# Altium project Humpback.PrjPCB (part 3 of 4)

## Sheet FPGA_Config.SchDoc: Humpback
size 420 x 297 mm; EDA_Number: ARTIQ; Projet: Humpback; Author: G.Kasprowicz; CompanyName: WUT ISE; DrawnBy: G.Kasprowicz; Organization: WUT ISE; Address1: PW ISE; Address2: Nowowiejska 15/19 00-665 Warsaw; Address3: gkasprow@gmail.com; DocumentNumber: 4; Revision: 1.0; SheetNumber: 4; SheetTotal: 11; ModifiedBy: -; CheckedDate: -; Title2: FPGA Configuration v1.0; DivGrp: WUT ISE; Designer: G.Kasprowicz; ModifiedDate: -; ProjectName: Sensor Box
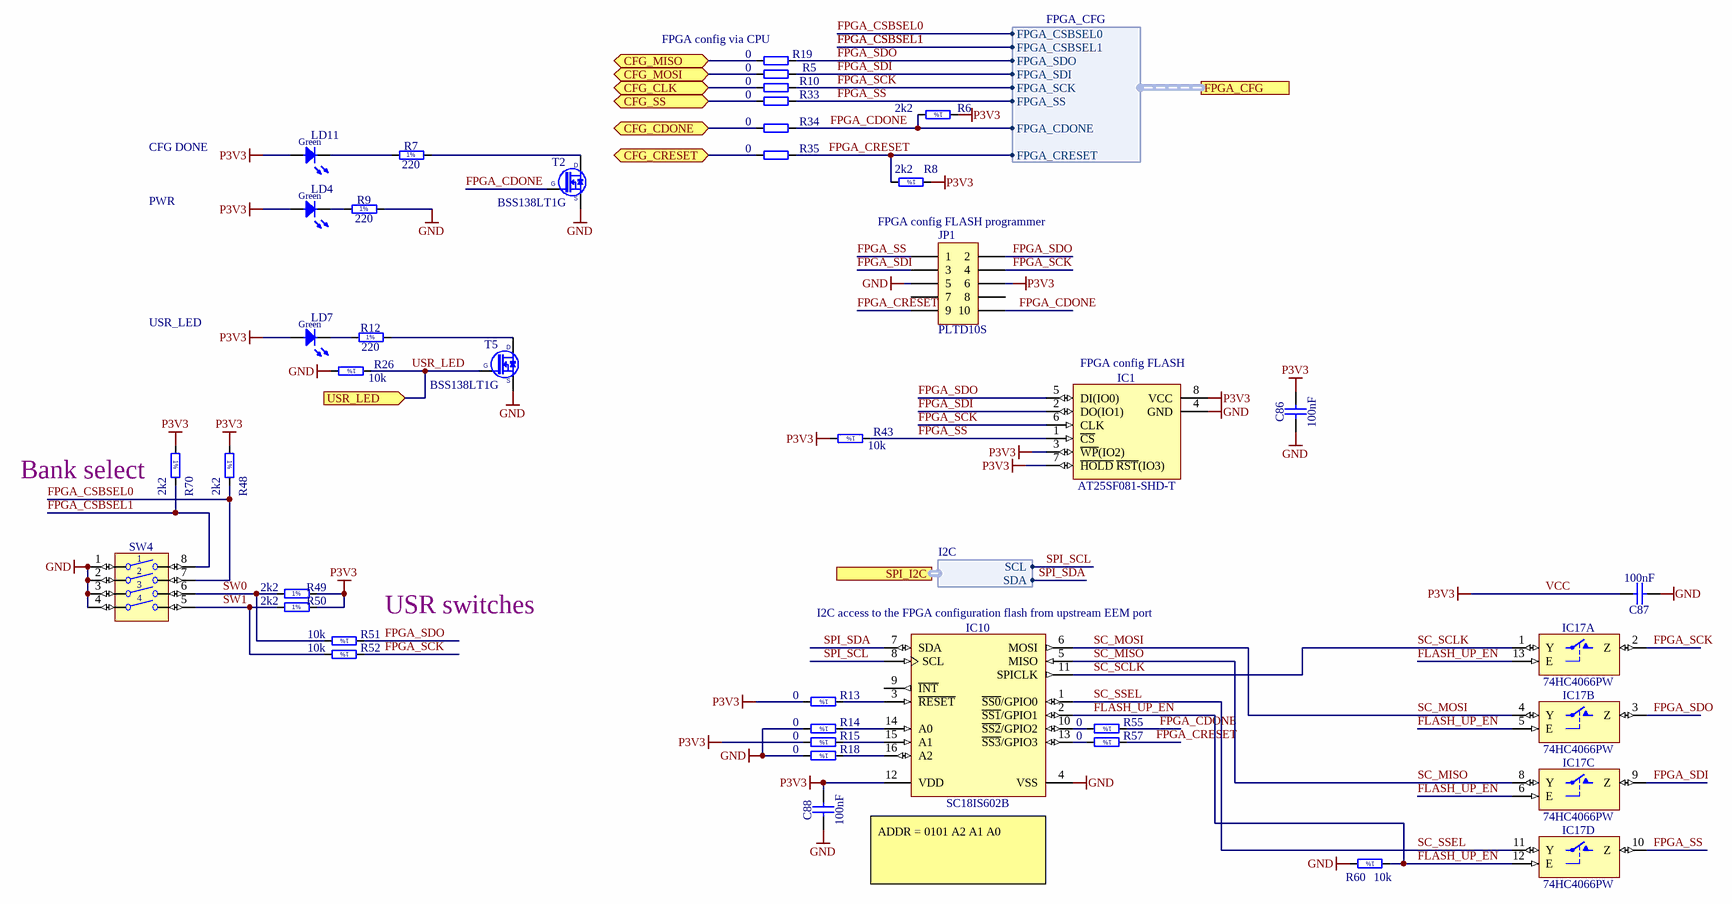
[diagram p5: FPGA_Config.SchDoc]

### Parts
C86  100nF  [CAPC1005X55N]
C87  100nF  [CAPC1005X55N]
C88  100nF  [CAPC1005X55N]
IC1  AT25SF081-SHD-T  [SOIC127P790X216-8N]
IC10  SC18IS602B  [SOP65P640X110-16N]
IC17  74HC4066PW  [SOP65P640X110-14N]  (parts A,B,C,D of 4)
JP1  PLTD10S  [PLTD10S]
LD4  Green  [LED_AVAGO_HSME-C120]  (value not drawn)
LD7  Green  [LED_AVAGO_HSME-C120]  (value not drawn)
LD11  Green  [LED_AVAGO_HSME-C120]  (value not drawn)
R5  0  [RESC1608X55N]
R6  2k2  [RESC1005X40N]
R7  220  [RESC1608X55N]
R8  2k2  [RESC1005X40N]
R9  220  [RESC1608X55N]
R10  0  [RESC1608X55N]
R12  220  [RESC1608X55N]
R13  0  [RESC1608X55N]
R14  0  [RESC1608X55N]
R15  0  [RESC1608X55N]
R18  0  [RESC1608X55N]
R19  0  [RESC1608X55N]
R26  10k  [RESC1005X40N]
R33  0  [RESC1608X55N]
R34  0  [RESC1608X55N]
R35  0  [RESC1608X55N]
R43  10k  [RESC1005X40N]
R48  2k2  [RESC1005X40N]
R49  2k2  [RESC1005X40N]
R50  2k2  [RESC1005X40N]
R51  10k  [RESC1005X40N]
R52  10k  [RESC1005X40N]
R55  0  [RESC1608X55N]
R57  0  [RESC1608X55N]
R60  10k  [RESC1005X40N]
R70  2k2  [RESC1005X40N]
SW4  Switch  [SW_TYCO_1571983-4]  (value not drawn)
T2  BSS138LT1G  [SOT95P240X110-3N]
T5  BSS138LT1G  [SOT95P240X110-3N]

### Ports
CFG_CDONE (bidir), CFG_CLK (bidir), CFG_CRESET (bidir), CFG_MISO (bidir), CFG_MOSI (bidir), CFG_SS (bidir), FPGA_CFG (harness FPGA_CFG), SPI_I2C (harness I2C), USR_LED (in)

### Harnesses
I2C: SDA, SCL
FPGA_CFG: FPGA_CSBSEL0, FPGA_CSBSEL1, FPGA_SDO, FPGA_SDI, FPGA_SCK, FPGA_SS, FPGA_CDONE, FPGA_CRESET

### Nets
GND: C86.1 C87.1 C88.1 IC1.4(GND) IC10.4(VSS) IC17.7(GND) JP1.5 R9.2 R14.2 R18.2 R26.2 R60.2 SW4.1 SW4.2 SW4.3 SW4.4 T2.2(S) T5.2(S)
P3V3: C86.2 C87.2 C88.2 IC1.3(~{WP}(IO2)) IC1.7(~{HOLD}_~{RST}(IO3)) IC1.8(VCC) IC10.12(VDD) IC17.14(VCC) JP1.6 LD4.2(A) LD7.2(A) LD11.2(A) R6.1 R8.1 R13.2 R15.2 R43.2 R48.1 R49.2 R50.2 R70.1  [also labelled VCC]
CFG_CDONE: R34.1 ; port CFG_CDONE
CFG_CLK: R10.1 ; port CFG_CLK
CFG_CRESET: R35.1 ; port CFG_CRESET
CFG_MISO: R19.1 ; port CFG_MISO
CFG_MOSI: R5.1 ; port CFG_MOSI
CFG_SS: R33.1 ; port CFG_SS
FLASH_UP_EN: IC10.2(~{SS1}/GPIO1) IC17.5(E) IC17.6(E) IC17.12(E) IC17.13(E) R60.1
FPGA_CDONE: JP1.10 R6.2 R34.2 R55.1 T2.1(G) ; port FPGA_CFG.FPGA_CDONE
FPGA_CRESET: JP1.9 R8.2 R35.2 R57.1 ; port FPGA_CFG.FPGA_CRESET
FPGA_CSBSEL0: R48.2 SW4.7 ; port FPGA_CFG.FPGA_CSBSEL0
FPGA_CSBSEL1: R70.2 SW4.8 ; port FPGA_CFG.FPGA_CSBSEL1
FPGA_SCK: IC1.6(CLK) IC17.2(Z) JP1.4 R10.2 R52.1 ; port FPGA_CFG.FPGA_SCK
FPGA_SDI: IC1.2(DO(IO1)) IC17.9(Z) JP1.3 R5.2 ; port FPGA_CFG.FPGA_SDI
FPGA_SDO: IC1.5(DI(IO0)) IC17.3(Z) JP1.2 R19.2 R51.1 ; port FPGA_CFG.FPGA_SDO
FPGA_SS: IC1.1(~{CS}) IC17.10(Z) JP1.1 R33.2 R43.1 ; port FPGA_CFG.FPGA_SS
SC_MISO: IC10.5(MISO) IC17.8(Y)
SC_MOSI: IC10.6(MOSI) IC17.4(Y)
SC_SCLK: IC10.11(SPICLK) IC17.1(Y)
SC_SSEL: IC10.1(~{SS0}/GPIO0) IC17.11(Y)
SPI_SCL: IC10.8(SCL) ; port SPI_I2C.SCL
SPI_SDA: IC10.7(SDA) ; port SPI_I2C.SDA
SW0: R49.1 R51.2 SW4.6
SW1: R50.1 R52.2 SW4.5
USR_LED: R26.1 T5.1(G) ; port USR_LED
NetIC10_3: IC10.3(~{RESET}) R13.1
NetIC10_10: IC10.10(~{SS2}/GPIO2) R55.2
NetIC10_13: IC10.13(~{SS3}/GPIO3) R57.2
NetIC10_14: IC10.14(A0) R14.1
NetIC10_15: IC10.15(A1) R15.1
NetIC10_16: IC10.16(A2) R18.1
NetLD4_1: LD4.1(C) R9.1
NetLD7_1: LD7.1(C) R12.1
NetLD11_1: LD11.1(C) R7.1
NetR7_2: R7.2 T2.3(D)
NetR12_2: R12.2 T5.3(D)

Not connected (* = marked no-connect by the designer): IC10 9(~{INT}); JP1 7 8

### Notes on the sheet
- (near R19) FPGA config via CPU
- CFG DONE
- PWR
- FPGA config FLASH programmer
- USR_LED
- (near IC1) FPGA config FLASH
- (near R70) Bank select
- USR switches
- (near IC10) I2C access to the FPGA configuration flash from upstream EEM port
- ADDR = 0101 A2 A1 A0
- Project/Equipment
- Document
- Designer
- Drawn by
- Check.by
- Copyright WUT ISE 2018.
  This documentation describes Open Hardware and is licensed under the CERN OHL v.1.1. You may redistribute and modify this documentation under the terms of the CERN OHL v.1.1. (http://ohwr.org/CERNOHL). This documentation is distributed WITHOUT ANY EXPRESS OR IMPLIED WARRANTY, INCLUDING OF MERCHANTABILITY, SATISFACTORY QUALITY AND FITNESS FOR A PARTICULAR PURPOSE. Please see the CERN OHL v.1.1 for applicable conditions.
- Contact
- File
- Last Mod.
- Print Date
- Sheet
- Size
- A3
- of
- Rev
- (in symbol R0402_2K2_1%_0.0625W_100PPM) 1%
- (in symbol R0402_10K_1%_0.0625W_100PPM) 1%
- (in symbol R0603_0R_JUMPER) 1%
- (in symbol R0603_220R_1%_0.1W_100PPM) 1%

### Library data of the parts
C86-C88 = CC0402_100NF_16V_10%_X5R: Non-polarised capacitor; Part Description: SMD Multilayer Chip Ceramic Capacitor; Manufacturer: GENERIC; Manufacturer1 Part Number: GRM155R61C104KA88D; Voltage: 16V; TC: X5R; Tolerance: ±10%; Part Number: CC0402_100NF_16V_10%_X5R; Component Kind: Standard; Component Type: Standard; Pin Count: 2; Value: 100nF; Status: None; Manufacturer Part Number: CC0402_100NF_16V_10%_X5R; Case: 0402; Mounted: Yes; Socket: No; SMD: Yes; Sense: No; Manufacturer1 Example: MURATA; Manufacturer1 ComponentHeight: 0.55mm; HelpURL: \\cern.ch\dfs\Applications\Altium\Datasheets\CC0402_X5R_MURATA_GRM.pdf; Author: CERN DEM JLC; CreateDate: 10.12.2013; LatestRevisionDate: 10.12.2013
IC1 = MEM_AT25SF081-SHD-T: 8M-bit Serial Flash Memory with uniform 4KB sectors and Dual/Quad SPI and QPI; Manufacturer: ADESTO; PressFit: No; Bonding: No; Part Number: AT25SF081-SHD-T; Component Kind: Standard; Component Type: Standard; Device: AT25SF081-SHD-T; PackageDescription: SOIC, 1.27mm Pitch; 8 Pin, 5.285mm W X 5.335mm L X 2.16mm H body, IPC Medium Density; Part Description: 8M-bit Serial Flash Memory with uniform 4KB sectors and Dual/Quad SPI and QPI; Manufacturer Part Number: AT25SF081-SHD-T; Pin Count: 8; Case: SOIC8; Mounted: Yes; Socket: No; SMD: Yes; Sense: No; ComponentHeight: 2.16mm; HelpURL: \\cern.ch\dfs\Applications\Altium\Datasheets\W25Q128FVSIG.pdf; Author: GK; CreateDate: 26/01/2018; LatestRevisionDate: 26/01/2018
IC10 = SC18IS602B: I2C-bus to SPI bridge; Manufacturer: NXP SEMICONDUCTORS; PressFit: No; Bonding: No; Part Number: SC18IS602B; Component Kind: Standard; Component Type: Standard; Device: SC18IS602B; PackageDescription: SOP, 0.65mm pitch; 16 pin, 4.40mm W X 5.00mm L X 1.10mm H body IPC Medium Density; Part Description: I2C-Bus to SPI Bridge; Manufacturer Part Number: SC18IS602B; Pin Count: 16; Case: TSSOP16; Mounted: Yes; Socket: No; SMD: Yes; Sense: No; ComponentHeight: 1.1mm; HelpURL: \\cern.ch\dfs\Applications\Altium\Datasheets\SC18IS602B.pdf; Author: CERN DEM MR; CreateDate: 14/12/2015; LatestRevisionDate: 14/12/2015
IC17 = 74HC4066PW: Part Description: Quad Single-Pole Single-Throw Analog Switch; Manufacturer: NXP SEMICONDUCTORS; PressFit: No; Bonding: No; Table: Standard Logic; Part Number: 74HC4066PW; Component Kind: Standard; Component Type: Standard; Device: 74HC4066PW; PackageDescription: SOP, 14-Leads, Body 4.4x5mm (max), Pitch 0.65mm, IPC Medium Density; Manufacturer Part Number: 74HC4066PW; Pin Count: 14; Case: TSSOP14; Mounted: Yes; Socket: No; SMD: Yes; ComponentHeight: 1.1mm; Author: CERN DEM JLC; HelpURL: \\cern.ch\dfs\Applications\Altium\Datasheets\74HC4066PW.pdf; CreateDate: 2014-11-19; LatestRevisionDate: 2014-11-19
JP1 = CON_2x5 2.54 male SMT: Goldpin 2.54mm, male header
LD4 LD7 LD11 = LED_AVAGO_HSME-C120: LED Green 1C 2A; Part Description: High Performance Right Angle Chip Green LED; Manufacturer: AVAGO TECHNOLOGIES; PressFit: No; Bonding: No; Part Number: LED_AVAGO_HSME-C120; Component Kind: Standard; Component Type: Standard; Color: Green; PackageDescription: Green Chip LED, 2-Leads, Body 1.7x1.1mm, Side Emitting Package; Manufacturer Part Number: HSME-C120; Pin Count: 2; Mounted: Yes; Socket: No; SMD: Yes; Sense: No; ComponentHeight: 0.7mm; HelpURL: \\cern.ch\dfs\Applications\Altium\Datasheets\LED_AVAGO_HSME-C120.pdf; ComponentLink1URL: \\cern.ch\dfs\Applications\Altium\Datasheets\LED_AVAGO_HSME-C110_DESIGN-GUIDE.pdf; ComponentLink1Description: Design Guide; Author: CERN DEM JMW; CreateDate: 22.07.2009; LatestRevisionDate: 20.06.2012
R5 R10 R19 R33-R35 = R0603_0R_JUMPER: Resistor; Part Description: 1A (0.05R Max DC Resistance) Zero Ohm Jumper; Manufacturer: GENERIC; Manufacturer1 Part Number: NRC06Z0; PressFit: No; Part Number: R0603_0R_JUMPER; Component Kind: Standard; Component Type: Standard; Pin Count: 2; Value: 0; Status: Preferred; Manufacturer Part Number: R0603_0R_JUMPER; Case: 0603; Mounted: Yes; Sense: No; Socket: No; SMD: Yes; Manufacturer1 Example: NIC COMPONENT; Manufacturer1 ComponentHeight: 0.55mm; HelpURL: \\cern.ch\dfs\Applications\Altium\Datasheets\R0603_NIC_NRC.pdf; Author: CERN DEM JLC; CreateDate: 03/12/2007; LatestRevisionDate: 13/03/2008
R6 R8 R48-R50 R70 = R0402_2K2_1%_0.0625W_100PPM: Resistor - 1%; Part Description: General Purpose Thick Film Chip Resistor; Manufacturer: GENERIC; Manufacturer1 Part Number: 232270672202L; TC: ±100ppm/°C; Table: Resistors SMD; Part Number: R0402_2K2_1%_0.0625W_100PPM; Component Kind: Standard; Component Type: Standard; Pin Count: 2; Value: 2k2; Status: Not recommended; Power: 0.0625W; Tolerance: ±1%; Manufacturer Part Number: R0402_2K2_1%_0.0625W_100PPM; Case: 0402; Mounted: Yes; Socket: No; SMD: Yes; Manufacturer1 Example: YAGEO PHYCOMP; Manufacturer1 ComponentHeight: 0.4mm; HelpURL: \\cern.ch\dfs\Applications\Altium\Datasheets\R0402_Phycomp_RC0402.pdf; Author: CERN DEM JLC; CreateDate: 2007-12-03; LatestRevisionDate: 2012-10-17
R7 R9 R12 = R0603_220R_1%_0.1W_100PPM: Resistor - 1%; Part Description: General Purpose Thick Film Chip Resistor; Manufacturer: GENERIC; Manufacturer1 Part Number: NRC06F2200TRF; Power: 0.1W; TC: ±100ppm/°C; Part Number: R0603_220R_1%_0.1W_100PPM; Component Kind: Standard; Component Type: Standard; Pin Count: 2; Value: 220; Status: Preferred; Tolerance: ±1%; Manufacturer Part Number: R0603_220R_1%_0.1W_100PPM; Case: 0603; Mounted: Yes; Sense: No; Socket: No; SMD: Yes; Manufacturer1 Example: NIC COMPONENT; Manufacturer1 ComponentHeight: 0.55mm; HelpURL: \\cern.ch\dfs\Applications\Altium\Datasheets\R0603_NIC_NRC.pdf; Author: CERN DEM JLC; CreateDate: 03.12.2007; LatestRevisionDate: 13.03.2008
R13-R15 R18 R55 R57 = R0603_0R_JUMPER: Resistor - 1%; Part Description: 1A (0.05R Max DC Resistance) Zero Ohm Jumper; Manufacturer: GENERIC; Manufacturer1 Part Number: NRC06Z0; Table: Resistors SMD; Part Number: R0603_0R_JUMPER; Component Kind: Standard; Component Type: Standard; Pin Count: 2; Value: 0; Status: Preferred; Manufacturer Part Number: R0603_0R_JUMPER; Case: 0603; Mounted: Yes; Socket: No; SMD: Yes; Manufacturer1 Example: NIC COMPONENT; Manufacturer1 ComponentHeight: 0.55mm; HelpURL: \\cern.ch\dfs\Applications\Altium\Datasheets\R0603_NIC_NRC.pdf; Author: CERN DEM JLC; CreateDate: 2007-12-03; LatestRevisionDate: 2008-03-13
R26 R43 R51 R52 R60 = R0402_10K_1%_0.0625W_100PPM: Resistor - 1%; Part Description: General Purpose Thick Film Chip Resistor; Manufacturer: GENERIC; Manufacturer1 Part Number: 232270671003L; TC: ±100ppm/°C; Table: Resistors SMD; Part Number: R0402_10K_1%_0.0625W_100PPM; Component Kind: Standard; Component Type: Standard; Pin Count: 2; Value: 10k; Status: Not recommended; Power: 0.0625W; Tolerance: ±1%; Manufacturer Part Number: R0402_10K_1%_0.0625W_100PPM; Case: 0402; Mounted: Yes; Socket: No; SMD: Yes; Manufacturer1 Example: YAGEO PHYCOMP; Manufacturer1 ComponentHeight: 0.4mm; HelpURL: \\cern.ch\dfs\Applications\Altium\Datasheets\R0402_Phycomp_RC0402.pdf; Author: CERN DEM JLC; CreateDate: 2007-12-03; LatestRevisionDate: 2012-10-17
SW4 = SW_TYCO_1571983-4: 4 Ways SPST DIP Switch; Part Description: 4 Way SPST SMD DIP Switch, Latched, Contact Rating 0.025A 24VDC; Manufacturer: TYCO; Manufacturer Part Number: 1571983-4 or GDH04S04; PressFit: No; Part Number: SW_TYCO_1571983-4; Component Kind: Standard; Component Type: Standard; Pin Count: 8; PackageDescription: Pitch 1.27mm,  Body 6.2x6.2mm, 4 Ways SPST Surface-Mount DIP Switch, TYCO GDH Series; Family: Switch; Mounted: Yes; Socket: No; SMD: Yes; Sense: No; Status: None; ComponentHeight: 2.31mm; HelpURL: \\cern.ch\dfs\Applications\Altium\Datasheets\SW_TYCO_1571983-4.pdf; Author: CERN DEM JLC; CreateDate: 08/01/2009; LatestRevisionDate: 08/01/2009
T2 T5 = BSS138LT1G: N-CHANNEL MOSFET WITH DIODE; Part Description: 50V 200mA N-Channel Enhancement Mode Field-Effect Transistor; Manufacturer: ON SEMICONDUCTOR; PressFit: No; Bonding: No; Part Number: BSS138LT1G; Component Kind: Standard; Component Type: Standard; Device: BSS138LT1G; PackageDescription: SOT23 3-Leads, Pitch 0.95mm - Body 1.4x3mm, IPC Medium Density; Manufacturer Part Number: BSS138LT1G; Pin Count: 3; Case: SOT23-3; Mounted: Yes; Socket: No; SMD: Yes; Sense: No; ComponentHeight: 1.11mm; HelpURL: \\cern.ch\dfs\Applications\Altium\Datasheets\BSS138LT1G.pdf; Author: CERN DEM JLC; CreateDate: 23/03/2009; LatestRevisionDate: 23/03/2009

## Sheet ESP32.SchDoc: Humpback
size 420 x 297 mm; Author: G.Kasprowicz; CompanyName: WUT ISE; DrawnBy: G.Kasprowicz; Organization: WUT ISE; Address1: PW ISE; Address2: Nowowiejska 15/19 00-665 Warsaw; Address3: gkasprow@gmail.com; DocumentNumber: 9; Revision: 1.0; SheetNumber: 9; SheetTotal: 11; ModifiedBy: -; CheckedDate: -; Title2: ESP32 v1.0; DivGrp: WUT ISE; Designer: G.Kasprowicz; ModifiedDate: -; ProjectName: Sensor Box
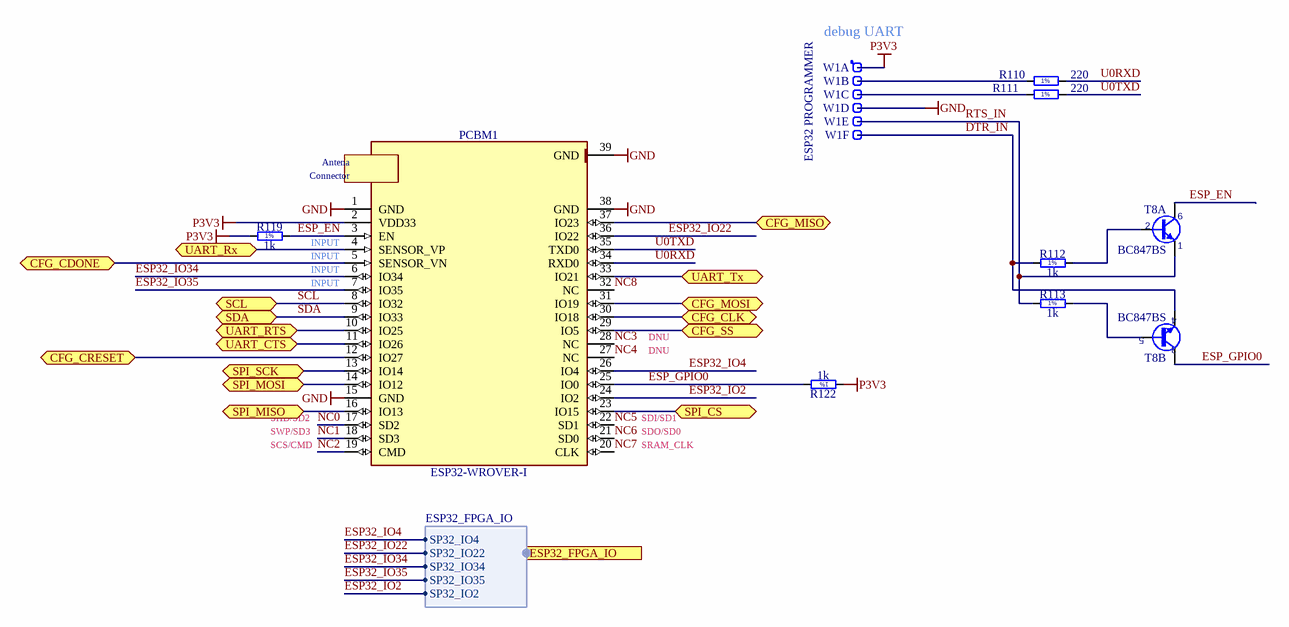
[diagram p6: ESP32.SchDoc]

### Parts
PCBM1  ESP32-WROVER-I  [PCBM_ESP32-WROVER-I]
R110  220  [RESC1005X40N]
R111  220  [RESC1005X40N]
R112  1k  [RESC1005X40N]
R113  1k  [RESC1005X40N]
R119  1k  [RESC1005X40N]
R122  1k  [RESC1005X40N]
T8  BC847BS  [SOT65P210X110-6N]  (parts A,B of 2)
W1  Header 6  [SAMTEC_MTLW-106-07-L-S-250]  (value not drawn)  (parts A,B,C,D,E,F of 6)

### Ports
CFG_CDONE (bidir), CFG_CLK (bidir), CFG_CRESET (bidir), CFG_MISO (bidir), CFG_MOSI (bidir), CFG_SS (bidir), ESP32_FPGA_IO (harness ESP32_FPGA_IO), SCL (bidir), SDA (bidir), SPI_CS (bidir), SPI_MISO (bidir), SPI_MOSI (bidir), SPI_SCK (bidir), UART_CTS (bidir), UART_RTS (bidir), UART_Rx (bidir), UART_Tx (bidir)

### Harnesses
ESP32_FPGA_IO: SP32_IO4, SP32_IO22, SP32_IO34, SP32_IO35, SP32_IO2

### Nets
GND: PCBM1.1(GND) PCBM1.15(GND) PCBM1.38(GND) PCBM1.39(GND) W1.4
P3V3: PCBM1.2(VDD33) R119.1 R122.1 W1.1
CFG_CDONE: PCBM1.5(SENSOR_VN) ; port CFG_CDONE
CFG_CLK: PCBM1.30(IO18) ; port CFG_CLK
CFG_CRESET: PCBM1.12(IO27) ; port CFG_CRESET
CFG_MISO: PCBM1.37(IO23) ; port CFG_MISO
CFG_MOSI: PCBM1.31(IO19) ; port CFG_MOSI
CFG_SS: PCBM1.29(IO5) ; port CFG_SS
DTR_IN: R112.1 T8.4(E) W1.6
ESP32_IO2: PCBM1.24(IO2) ; port ESP32_FPGA_IO.SP32_IO2
ESP32_IO4: PCBM1.26(IO4) ; port ESP32_FPGA_IO.SP32_IO4
ESP32_IO22: PCBM1.36(IO22) ; port ESP32_FPGA_IO.SP32_IO22
ESP32_IO34: PCBM1.6(IO34) ; port ESP32_FPGA_IO.SP32_IO34
ESP32_IO35: PCBM1.7(IO35) ; port ESP32_FPGA_IO.SP32_IO35
ESP_EN: PCBM1.3(EN) R119.2 T8.6(C)
ESP_GPIO0: PCBM1.25(IO0) R122.2 T8.3(C)
NC0: PCBM1.17(SD2)
NC1: PCBM1.18(SD3)
NC2: PCBM1.19(CMD)
NC3: PCBM1.28(NC)
NC4: PCBM1.27(NC)
NC5: PCBM1.22(SD1)
NC6: PCBM1.21(SD0)
NC7: PCBM1.20(CLK)
NC8: PCBM1.32(NC)
RTS_IN: R113.1 T8.1(E) W1.5
SCL: PCBM1.8(IO32) ; port SCL
SDA: PCBM1.9(IO33) ; port SDA
SPI_CS: PCBM1.23(IO15) ; port SPI_CS
SPI_MISO: PCBM1.16(IO13) ; port SPI_MISO
SPI_MOSI: PCBM1.14(IO12) ; port SPI_MOSI
SPI_SCK: PCBM1.13(IO14) ; port SPI_SCK
U0RXD: PCBM1.34(RXD0) R110.2
U0TXD: PCBM1.35(TXD0) R111.2
UART_CTS: PCBM1.11(IO26) ; port UART_CTS
UART_RTS: PCBM1.10(IO25) ; port UART_RTS
UART_Rx: PCBM1.4(SENSOR_VP) ; port UART_Rx
UART_Tx: PCBM1.33(IO21) ; port UART_Tx
NetR110_1: R110.1 W1.2
NetR111_1: R111.1 W1.3
NetR112_2: R112.2 T8.2(B)
NetR113_2: R113.2 T8.5(B)

### Notes on the sheet
- (near W1) debug UART
- (near W1) ESP32 PROGRAMMER
- INPUT
- DNU
- SHD/SD2
- SDI/SD1
- SWP/SD3
- SCS/CMD
- SDO/SD0
- SRAM_CLK
- Project/Equipment
- Document
- Designer
- Drawn by
- Check.by
- Copyright WUT ISE 2018.
  This documentation describes Open Hardware and is licensed under the CERN OHL v.1.1. You may redistribute and modify this documentation under the terms of the CERN OHL v.1.1. (http://ohwr.org/CERNOHL). This documentation is distributed WITHOUT ANY EXPRESS OR IMPLIED WARRANTY, INCLUDING OF MERCHANTABILITY, SATISFACTORY QUALITY AND FITNESS FOR A PARTICULAR PURPOSE. Please see the CERN OHL v.1.1 for applicable conditions.
- Contact
- File
- Last Mod.
- Print Date
- Sheet
- Size
- A3
- of
- Rev
- (in symbol PCBM_ESP32-WROVER-I) Antena; Connector
- (in symbol R0402_1K_1%_0.0625W_100PPM) 1%
- (in symbol R0402_220R_1%_0.0625W_100PPM) 1%

### Library data of the parts
PCBM1 = PCBM_ESP32-WROVER-I: Generic WiFi-BT-BLE MCU Module; Part Description: Generic WiFi-BT-BLE MCU Module (IPEX antenna, 32-Mbit PSRAM); Manufacturer: ESPRESSIF; PressFit: No; Bonding: No; Part Number: PCBM_ESP32-WROVER-I; Component Kind: Standard; Component Type: Standard; Device: ESP32-WROVER-I; PackageDescription: Generic WiFi-BT-BLE MCU Module (IPEX antenna) ,Body 18.00mm x 31.4mm; Manufacturer Part Number: ESP32-WROVER-I; Pin Count: 39; Mounted: Yes; Socket: No; SMD: Yes; Sense: No; ComponentHeight: 3.65mm; Author: CERN DEM JLC; HelpURL: \\cern.ch\dfs\Applications\Altium\Datasheets\PCBM_ESP32-WROVER-I.pdf; CreateDate: 14/11/2017; LatestRevisionDate: 14/11/2017
R110 R111 = R0402_220R_1%_0.0625W_100PPM: Resistor - 1%; Part Description: General Purpose Thick Film Chip Resistor; Manufacturer: GENERIC; Manufacturer1 Part Number: 232270672201L; TC: ±100ppm/°C; PressFit: No; Part Number: R0402_220R_1%_0.0625W_100PPM; Component Kind: Standard; Component Type: Standard; Pin Count: 2; Value: 220; Status: Not Recommended; Power: 0.0625W; Tolerance: ±1%; Manufacturer Part Number: R0402_220R_1%_0.0625W_100PPM; Case: 0402; Mounted: Yes; Sense: No; Socket: No; SMD: Yes; Manufacturer1 Example: YAGEO PHYCOMP; Manufacturer1 ComponentHeight: 0.4mm; HelpURL: \\cern.ch\dfs\Applications\Altium\Datasheets\R0402_Phycomp_RC0402.pdf; Author: CERN DEM JLC; CreateDate: 03.12.2007; LatestRevisionDate: 17.10.2012
R112 R113 R119 R122 = R0402_1K_1%_0.0625W_100PPM: Resistor - 1%; Part Description: General Purpose Thick Film Chip Resistor; Manufacturer: GENERIC; Manufacturer1 Part Number: 232270671002L; TC: ±100ppm/°C; PressFit: No; Part Number: R0402_1K_1%_0.0625W_100PPM; Component Kind: Standard; Component Type: Standard; Pin Count: 2; Value: 1k; Status: Not Recommended; Power: 0.0625W; Tolerance: ±1%; Manufacturer Part Number: R0402_1K_1%_0.0625W_100PPM; Case: 0402; Mounted: Yes; Sense: No; Socket: No; SMD: Yes; Manufacturer1 Example: YAGEO PHYCOMP; Manufacturer1 ComponentHeight: 0.4mm; HelpURL: \\cern.ch\dfs\Applications\Altium\Datasheets\R0402_Phycomp_RC0402.pdf; Author: CERN DEM JLC; CreateDate: 03.12.2007; LatestRevisionDate: 17.10.2012
T8 = BC847BS: 45V 100mA Dual NPN General-Purpose Transistor; Manufacturer: NXP SEMICONDUCTORS; PressFit: No; Bonding: No; Part Number: BC847BS; Component Kind: Standard; Component Type: Standard; Device: BC847BS; PackageDescription: SOT363, SC-88, SOT, 0.65mm Pitch, 6 pin, 1.25mm W X 2.00mm L X 1.10mm H, IPC Medium Density; Part Description: 45V 100mA Dual NPN General-Purpose Transistor; Manufacturer Part Number: BC847BS; Pin Count: 6; Case: SOT363; Mounted: Yes; Socket: No; SMD: Yes; Sense: No; ComponentHeight: 1.1mm; HelpURL: \\cern.ch\dfs\Applications\Altium\Datasheets\BC847BS.pdf; Author: CERN DEM JMW; CreateDate: 10.07.2015; LatestRevisionDate: 10.07.2015
W1 = SAMTEC_MTLW-106-07-L-S-250: 6 Mini Wire-Wrap Contact Strip Header; Part Description: 6 Contacts, Pitch 2.54mm, Single Row Through Mount Straight Header (Post Lead = 6.35mm, Tail Lead 3.05mm, Insulator 1.52mm); Manufacturer: SAMTEC; PressFit: No; Part Number: SAMTEC_MTLW-106-07-L-S-250; Component Kind: Standard; Component Type: Standard; Pin Count: 6; Family: Header 6; Mounted: Yes; Socket: No; Sense: No; SMD: No; Status: None; Manufacturer Part Number: MTLW-106-07-L-S-250; ComponentHeight: 7.87mm; HelpURL: \\cern.ch\dfs\Applications\Altium\Datasheets\SAMTEC_MTLW-106-07-L-S-250.pdf; Author: CERN DEM BC; CreateDate: 06/03/2017; LatestRevisionDate: 06/03/2017

## Sheet Orange_pi_zero.SchDoc: Humpback
size 420 x 297 mm; Author: G.Kasprowicz; CompanyName: WUT ISE; DrawnBy: G.Kasprowicz; Organization: WUT ISE; Address1: PW ISE; Address2: Nowowiejska 15/19 00-665 Warsaw; Address3: gkasprow@gmail.com; DocumentNumber: 10; Revision: 1.0; SheetNumber: 10; SheetTotal: 11; ModifiedBy: -; CheckedDate: -; Title2: OrangePi Zero; DivGrp: WUT ISE; Designer: G.Kasprowicz; ModifiedDate: -; ProjectName: Sensor Box
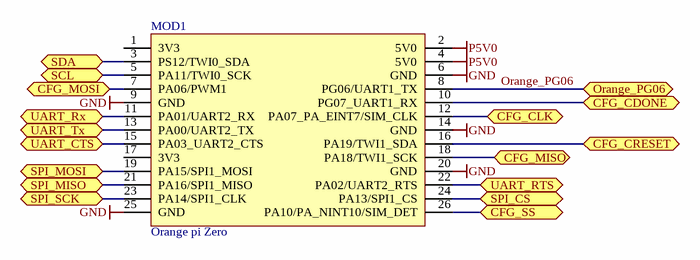
[diagram p7: Orange_pi_zero.SchDoc]

### Parts
MOD1  Orange pi Zero  [MOD_Orange_pi_Zero]

### Ports
CFG_CDONE (bidir), CFG_CLK (bidir), CFG_CRESET (bidir), CFG_MISO (bidir), CFG_MOSI (bidir), CFG_SS (bidir), Orange_PG06 (bidir), SCL (bidir), SDA (bidir), SPI_CS (bidir), SPI_MISO (bidir), SPI_MOSI (bidir), SPI_SCK (bidir), UART_CTS (bidir), UART_RTS (bidir), UART_Rx (bidir), UART_Tx (bidir)

### Nets
GND: MOD1.6(GND) MOD1.9(GND) MOD1.14(GND) MOD1.20(GND) MOD1.25(GND)
P5V0: MOD1.2(5V0) MOD1.4(5V0)
CFG_CDONE: MOD1.10(PG07_UART1_RX) ; port CFG_CDONE
CFG_CLK: MOD1.12(PA07_PA_EINT7/SIM_CLK) ; port CFG_CLK
CFG_CRESET: MOD1.16(PA19/TWI1_SDA) ; port CFG_CRESET
CFG_MISO: MOD1.18(PA18/TWI1_SCK) ; port CFG_MISO
CFG_MOSI: MOD1.7(PA06/PWM1) ; port CFG_MOSI
CFG_SS: MOD1.26(PA10/PA_NINT10/SIM_DET) ; port CFG_SS
Orange_PG06: MOD1.8(PG06/UART1_TX) ; port Orange_PG06
SCL: MOD1.5(PA11/TWI0_SCK) ; port SCL
SDA: MOD1.3(PS12/TWI0_SDA) ; port SDA
SPI_CS: MOD1.24(PA13/SPI1_CS) ; port SPI_CS
SPI_MISO: MOD1.21(PA16/SPI1_MISO) ; port SPI_MISO
SPI_MOSI: MOD1.19(PA15/SPI1_MOSI) ; port SPI_MOSI
SPI_SCK: MOD1.23(PA14/SPI1_CLK) ; port SPI_SCK
UART_CTS: MOD1.15(PA03_UART2_CTS) ; port UART_CTS
UART_RTS: MOD1.22(PA02/UART2_RTS) ; port UART_RTS
UART_Rx: MOD1.11(PA01/UART2_RX) ; port UART_Rx
UART_Tx: MOD1.13(PA00/UART2_TX) ; port UART_Tx

Not connected (* = marked no-connect by the designer): MOD1 1(3V3) 17(3V3)

### Notes on the sheet
- Project/Equipment
- Document
- Designer
- Drawn by
- Check.by
- Copyright WUT ISE 2018.
  This documentation describes Open Hardware and is licensed under the CERN OHL v.1.1. You may redistribute and modify this documentation under the terms of the CERN OHL v.1.1. (http://ohwr.org/CERNOHL). This documentation is distributed WITHOUT ANY EXPRESS OR IMPLIED WARRANTY, INCLUDING OF MERCHANTABILITY, SATISFACTORY QUALITY AND FITNESS FOR A PARTICULAR PURPOSE. Please see the CERN OHL v.1.1 for applicable conditions.
- Contact
- File
- Last Mod.
- Print Date
- Sheet
- Size
- A3
- of
- Rev

### Library data of the parts
MOD1 = MOD_Orange_pi_Zero

## Sheet STM32_Nucleo_144.SchDoc: Humpback
size 420 x 297 mm; Author: G.Kasprowicz; CompanyName: WUT ISE; DrawnBy: G.Kasprowicz; Organization: WUT ISE; Address1: PW ISE; Address2: Nowowiejska 15/19 00-665 Warsaw; Address3: gkasprow@gmail.com; DocumentNumber: 7; Revision: 1.0; SheetNumber: 7; SheetTotal: 11; ModifiedBy: -; CheckedDate: -; Title2: STM32 Nucleo / Arduino v1.0; DivGrp: WUT ISE; Designer: G.Kasprowicz; ModifiedDate: -; ProjectName: Sensor Box
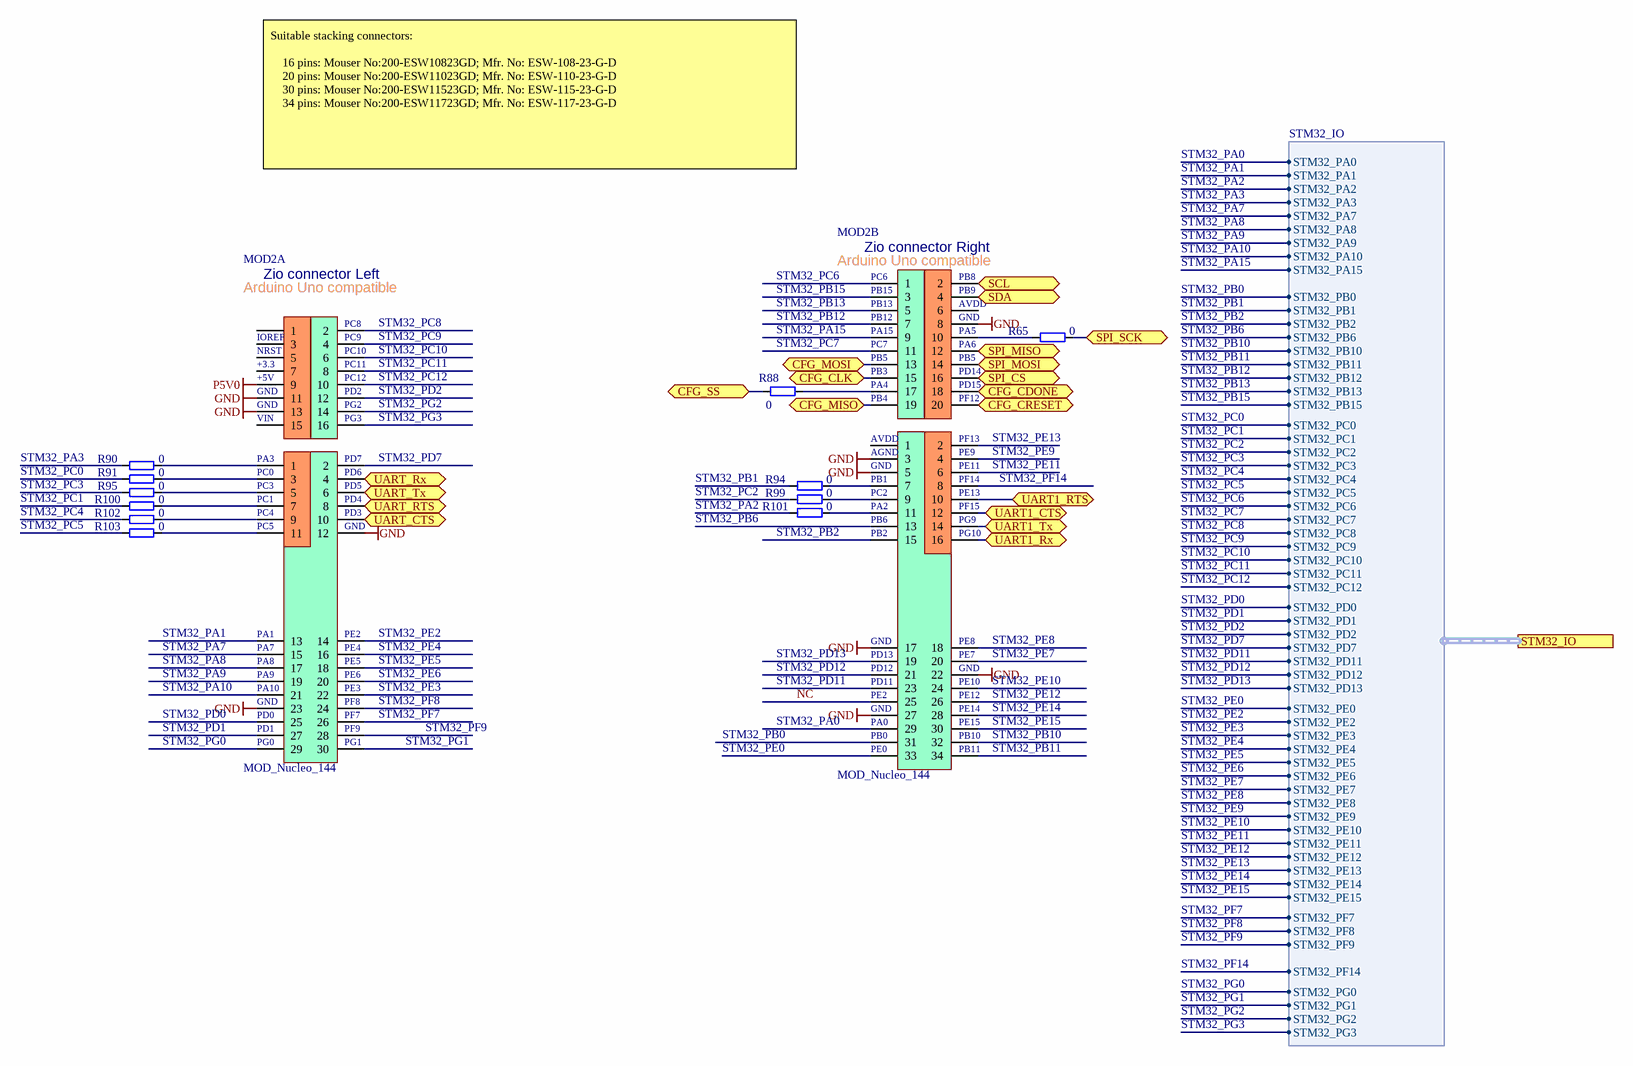
[diagram p8: STM32_Nucleo_144.SchDoc]

### Parts
MOD2  MOD_Nucleo_144  [MOD_STM32_Nucleo_144]  (parts A,B of 2)
R65  0  [RESC1608X55N]
R88  0  [RESC1608X55N]
R90  0  [RESC1608X55N]
R91  0  [RESC1608X55N]
R94  0  [RESC1608X55N]
R95  0  [RESC1608X55N]
R99  0  [RESC1608X55N]
R100  0  [RESC1608X55N]
R101  0  [RESC1608X55N]
R102  0  [RESC1608X55N]
R103  0  [RESC1608X55N]

### Ports
CFG_CDONE (bidir), CFG_CLK (bidir), CFG_CRESET (bidir), CFG_MISO (bidir), CFG_MOSI (bidir), CFG_SS (bidir), SCL (bidir), SDA (bidir), SPI_CS (bidir), SPI_MISO (bidir), SPI_MOSI (bidir), SPI_SCK (bidir), STM32_IO (harness STM32_IO), UART1_CTS (bidir), UART1_RTS (bidir), UART1_Rx (bidir), UART1_Tx (bidir), UART_CTS (bidir), UART_RTS (bidir), UART_Rx (bidir), UART_Tx (bidir)

### Harnesses
STM32_IO: STM32_PA0, STM32_PA1, STM32_PA2, STM32_PA3, STM32_PA7, STM32_PA8, STM32_PA9, STM32_PA10, STM32_PA15, STM32_PB0, STM32_PB1, STM32_PB2, STM32_PB6, STM32_PB10, STM32_PB11, STM32_PB12, STM32_PB13, STM32_PB15, STM32_PC0, STM32_PC1, STM32_PC2, STM32_PC3, STM32_PC4, STM32_PC5, STM32_PC6, STM32_PC7, STM32_PC8, STM32_PC9, STM32_PC10, STM32_PC11, STM32_PC12, STM32_PD0, STM32_PD1, STM32_PD2, STM32_PD7, STM32_PD11, STM32_PD12, STM32_PD13, STM32_PE0, STM32_PE2, STM32_PE3, STM32_PE4, STM32_PE5, STM32_PE6, STM32_PE7, STM32_PE8, STM32_PE9, STM32_PE10, STM32_PE11, STM32_PE12, STM32_PE13, STM32_PE14, STM32_PE15, STM32_PF7, STM32_PF8, STM32_PF9, STM32_PF14, STM32_PG0, STM32_PG1, STM32_PG2, STM32_PG3

### Nets
GND: MOD2.3d(3) MOD2.5d(5) MOD2.8c(8) MOD2.11a(11) MOD2.12b(12) MOD2.13a(13) MOD2.17d(17) MOD2.22d(22) MOD2.23b(23) MOD2.27d(27)
P5V0: MOD2.9a(9)
CFG_CDONE: MOD2.18c(18) ; port CFG_CDONE
CFG_CLK: MOD2.15c(15) ; port CFG_CLK
CFG_CRESET: MOD2.20c(20) ; port CFG_CRESET
CFG_MISO: MOD2.19c(19) ; port CFG_MISO
CFG_MOSI: MOD2.13c(13) ; port CFG_MOSI
CFG_SS: R88.1 ; port CFG_SS
NC: MOD2.25d(25)
SCL: MOD2.2c(2) ; port SCL
SDA: MOD2.4c(4) ; port SDA
SPI_CS: MOD2.16c(16) ; port SPI_CS
SPI_MISO: MOD2.12c(12) ; port SPI_MISO
SPI_MOSI: MOD2.14c(14) ; port SPI_MOSI
SPI_SCK: R65.2 ; port SPI_SCK
STM32_PA0: MOD2.29d(29) ; port STM32_IO.STM32_PA0
STM32_PA1: MOD2.13b(13) ; port STM32_IO.STM32_PA1
STM32_PA2: R101.1 ; port STM32_IO.STM32_PA2
STM32_PA3: R90.1 ; port STM32_IO.STM32_PA3
STM32_PA7: MOD2.15b(15) ; port STM32_IO.STM32_PA7
STM32_PA8: MOD2.17b(17) ; port STM32_IO.STM32_PA8
STM32_PA9: MOD2.19b(19) ; port STM32_IO.STM32_PA9
STM32_PA10: MOD2.21b(21) ; port STM32_IO.STM32_PA10
STM32_PA15: MOD2.9c(9) ; port STM32_IO.STM32_PA15
STM32_PB0: MOD2.31d(31) ; port STM32_IO.STM32_PB0
STM32_PB1: R94.1 ; port STM32_IO.STM32_PB1
STM32_PB2: MOD2.15d(15) ; port STM32_IO.STM32_PB2
STM32_PB6: MOD2.13d(13) ; port STM32_IO.STM32_PB6
STM32_PB10: MOD2.32d(32) ; port STM32_IO.STM32_PB10
STM32_PB11: MOD2.34d(34) ; port STM32_IO.STM32_PB11
STM32_PB12: MOD2.7c(7) ; port STM32_IO.STM32_PB12
STM32_PB13: MOD2.5c(5) ; port STM32_IO.STM32_PB13
STM32_PB15: MOD2.3c(3) ; port STM32_IO.STM32_PB15
STM32_PC0: R91.1 ; port STM32_IO.STM32_PC0
STM32_PC1: R100.1 ; port STM32_IO.STM32_PC1
STM32_PC2: R99.1 ; port STM32_IO.STM32_PC2
STM32_PC3: R95.1 ; port STM32_IO.STM32_PC3
STM32_PC4: R102.1 ; port STM32_IO.STM32_PC4
STM32_PC5: R103.1 ; port STM32_IO.STM32_PC5
STM32_PC6: MOD2.1c(1) ; port STM32_IO.STM32_PC6
STM32_PC7: MOD2.11c(11) ; port STM32_IO.STM32_PC7
STM32_PC8: MOD2.2a(2) ; port STM32_IO.STM32_PC8
STM32_PC9: MOD2.4a(4) ; port STM32_IO.STM32_PC9
STM32_PC10: MOD2.6a(6) ; port STM32_IO.STM32_PC10
STM32_PC11: MOD2.8a(8) ; port STM32_IO.STM32_PC11
STM32_PC12: MOD2.10a(10) ; port STM32_IO.STM32_PC12
STM32_PD0: MOD2.25b(25) ; port STM32_IO.STM32_PD0
STM32_PD1: MOD2.27b(27) ; port STM32_IO.STM32_PD1
STM32_PD2: MOD2.12a(12) ; port STM32_IO.STM32_PD2
STM32_PD7: MOD2.2b(2) ; port STM32_IO.STM32_PD7
STM32_PD11: MOD2.23d(23) ; port STM32_IO.STM32_PD11
STM32_PD12: MOD2.21d(21) ; port STM32_IO.STM32_PD12
STM32_PD13: MOD2.19d(19) ; port STM32_IO.STM32_PD13
STM32_PE0: MOD2.33d(33) ; port STM32_IO.STM32_PE0
STM32_PE2: MOD2.14b(14) ; port STM32_IO.STM32_PE2
STM32_PE3: MOD2.22b(22) ; port STM32_IO.STM32_PE3
STM32_PE4: MOD2.16b(16) ; port STM32_IO.STM32_PE4
STM32_PE5: MOD2.18b(18) ; port STM32_IO.STM32_PE5
STM32_PE6: MOD2.20b(20) ; port STM32_IO.STM32_PE6
STM32_PE7: MOD2.20d(20) ; port STM32_IO.STM32_PE7
STM32_PE8: MOD2.18d(18) ; port STM32_IO.STM32_PE8
STM32_PE9: MOD2.4d(4) ; port STM32_IO.STM32_PE9
STM32_PE10: MOD2.24d(24) ; port STM32_IO.STM32_PE10
STM32_PE11: MOD2.6d(6) ; port STM32_IO.STM32_PE11
STM32_PE12: MOD2.26d(26) ; port STM32_IO.STM32_PE12
STM32_PE13: MOD2.2d(2) ; port STM32_IO.STM32_PE13
STM32_PE14: MOD2.28d(28) ; port STM32_IO.STM32_PE14
STM32_PE15: MOD2.30d(30) ; port STM32_IO.STM32_PE15
STM32_PF7: MOD2.26b(26) ; port STM32_IO.STM32_PF7
STM32_PF8: MOD2.24b(24) ; port STM32_IO.STM32_PF8
STM32_PF9: MOD2.28b(28) ; port STM32_IO.STM32_PF9
STM32_PF14: MOD2.8d(8) ; port STM32_IO.STM32_PF14
STM32_PG0: MOD2.29b(29) ; port STM32_IO.STM32_PG0
STM32_PG1: MOD2.30b(30) ; port STM32_IO.STM32_PG1
STM32_PG2: MOD2.14a(14) ; port STM32_IO.STM32_PG2
STM32_PG3: MOD2.16a(16) ; port STM32_IO.STM32_PG3
UART1_CTS: MOD2.12d(12) ; port UART1_CTS
UART1_RTS: MOD2.10d(10) ; port UART1_RTS
UART1_Rx: MOD2.16d(16) ; port UART1_Rx
UART1_Tx: MOD2.14d(14) ; port UART1_Tx
UART_CTS: MOD2.10b(10) ; port UART_CTS
UART_RTS: MOD2.8b(8) ; port UART_RTS
UART_Rx: MOD2.4b(4) ; port UART_Rx
UART_Tx: MOD2.6b(6) ; port UART_Tx
NetMOD2_1b: MOD2.1b(1) R90.2
NetMOD2_3b: MOD2.3b(3) R91.2
NetMOD2_5b: MOD2.5b(5) R95.2
NetMOD2_7b: MOD2.7b(7) R100.2
NetMOD2_7d: MOD2.7d(7) R94.2
NetMOD2_9b: MOD2.9b(9) R102.2
NetMOD2_9d: MOD2.9d(9) R99.2
NetMOD2_10c: MOD2.10c(10) R65.1
NetMOD2_11b: MOD2.11b(11) R103.2
NetMOD2_11d: MOD2.11d(11) R101.2
NetMOD2_17c: MOD2.17c(17) R88.2

Not connected (* = marked no-connect by the designer): MOD2 1a(1) 1d(1) 3a(3) 5a(5) 6c(6) 7a(7) 15a(15)

### Notes on the sheet
- Suitable stacking connectors:
  16 pins: Mouser No:200-ESW10823GD; Mfr. No: ESW-108-23-G-D
  20 pins: Mouser No:200-ESW11023GD; Mfr. No: ESW-110-23-G-D
  30 pins: Mouser No:200-ESW11523GD; Mfr. No: ESW-115-23-G-D
  34 pins: Mouser No:200-ESW11723GD; Mfr. No: ESW-117-23-G-D
- Project/Equipment
- Document
- Designer
- Drawn by
- Check.by
- Copyright WUT ISE 2018.
  This documentation describes Open Hardware and is licensed under the CERN OHL v.1.1. You may redistribute and modify this documentation under the terms of the CERN OHL v.1.1. (http://ohwr.org/CERNOHL). This documentation is distributed WITHOUT ANY EXPRESS OR IMPLIED WARRANTY, INCLUDING OF MERCHANTABILITY, SATISFACTORY QUALITY AND FITNESS FOR A PARTICULAR PURPOSE. Please see the CERN OHL v.1.1 for applicable conditions.
- Contact
- File
- Last Mod.
- Print Date
- Sheet
- Size
- A3
- of
- Rev
- (in symbol MOD_Nucleo_144, part A) Zio connector Left; Arduino Uno compatible; PC8; IOREF; PC9; NRST; PC10; +3.3; PC11; +5V; PC12; GND; PD2; PG2; VIN; PG3; PA3; PD7; PC0; PD6; PC3; PD5; PC1; PD4; PC4; PD3; PC5; PA1; PE2; PA7; PE4; PA8; PE5; PA9; PE6; PA10; PE3; PF8; PD0; PF7; PD1; PF9; PG0; PG1
- (in symbol MOD_Nucleo_144, part B) Zio connector Right; Arduino Uno compatible; PC6; PB8; PB15; PB9; PB13; AVDD; PB12; GND; PA15; PA5; PC7; PA6; PB5; PB3; PD14; PA4; PD15; PB4; PF12; PF13; AGND; PE9; PE11; PB1; PF14; PC2; PE13; PA2; PF15; PB6; PG9; PB2; PG10; PE8; PD13; PE7; PD12; PD11; PE10; PE2; PE12; PE14; PA0; PE15; PB0; PB10; PE0; PB11

### Library data of the parts
R65 R88 R90 R91 R94 R95 R99-R103 = R0603_0R_JUMPER: as R5 on sheet FPGA_Config; Part Number: R0603_0R_JUMPER; Component Kind: Standard; Component Type: Standard; Pin Count: 2; Value: 0; Status: Preferred; Manufacturer Part Number: R0603_0R_JUMPER; Case: 0603; Mounted: Yes; Sense: No; Socket: No; SMD: Yes; Manufacturer1 Example: NIC COMPONENT; Manufacturer1 ComponentHeight: 0.55mm; HelpURL: \\cern.ch\dfs\Applications\Altium\Datasheets\R0603_NIC_NRC.pdf; Author: CERN DEM JLC; CreateDate: 03.12.2007; LatestRevisionDate: 13.03.2008

## Sheet Wiznet.SchDoc: Wiznet
size 420 x 297 mm; Author: G.Kasprowicz; CompanyName: WUT ISE; DrawnBy: G.Kasprowicz; Organization: WUT ISE; Address1: PW ISE; Address2: Nowowiejska 15/19 00-665 Warsaw; Address3: gkasprow@gmail.com; DocumentNumber: 11; Revision: 1.0; SheetNumber: 11; SheetTotal: 11; ModifiedBy: -; CheckedDate: -; Title2: Module; DivGrp: WUT ISE; Designer: G.Kasprowicz; ModifiedDate: -; ProjectName: Sensor Box
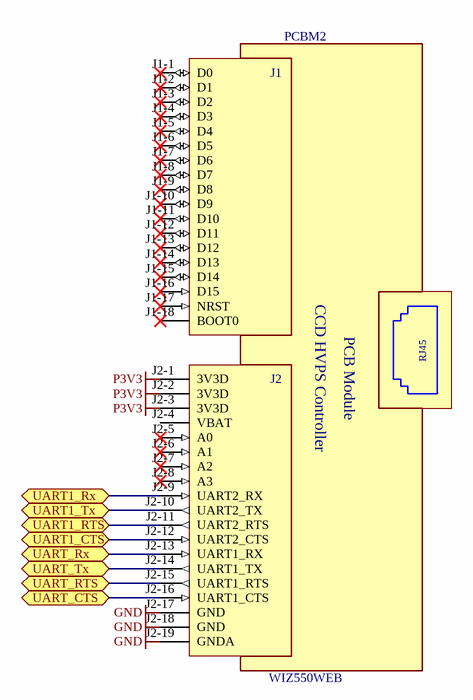
[diagram p9: Wiznet.SchDoc]

### Parts
PCBM2  WIZ550WEB  [PCBM_WIZNET_WIZ550WEB]

### Ports
UART1_CTS (bidir), UART1_RTS (bidir), UART1_Rx (bidir), UART1_Tx (bidir), UART_CTS (bidir), UART_RTS (bidir), UART_Rx (bidir), UART_Tx (bidir)

### Nets
GND: PCBM2.J2-17(GND) PCBM2.J2-18(GND) PCBM2.J2-19(GNDA)
P3V3: PCBM2.J2-1(3V3D) PCBM2.J2-2(3V3D) PCBM2.J2-3(3V3D)
UART1_CTS: PCBM2.J2-12(UART2_CTS) ; port UART1_CTS
UART1_RTS: PCBM2.J2-11(UART2_RTS) ; port UART1_RTS
UART1_Rx: PCBM2.J2-9(UART2_RX) ; port UART1_Rx
UART1_Tx: PCBM2.J2-10(UART2_TX) ; port UART1_Tx
UART_CTS: PCBM2.J2-16(UART1_CTS) ; port UART_CTS
UART_RTS: PCBM2.J2-15(UART1_RTS) ; port UART_RTS
UART_Rx: PCBM2.J2-13(UART1_RX) ; port UART_Rx
UART_Tx: PCBM2.J2-14(UART1_TX) ; port UART_Tx

Not connected (* = marked no-connect by the designer): PCBM2 J1-1(D0)* J1-2(D1)* J1-3(D2)* J1-4(D3)* J1-5(D4)* J1-6(D5)* J1-7(D6)* J1-8(D7)* J1-9(D8)* J1-10(D9)* J1-11(D10)* J1-12(D11)* J1-13(D12)* J1-14(D13)* J1-15(D14)* J1-16(D15)* J1-17(NRST)* J1-18(BOOT0)* J2-4(VBAT) J2-5(A0)* J2-6(A1)* J2-7(A2)* J2-8(A3)*

### Notes on the sheet
- Project/Equipment
- Document
- Designer
- Drawn by
- Check.by
- Copyright WUT ISE 2018.
  This documentation describes Open Hardware and is licensed under the CERN OHL v.1.1. You may redistribute and modify this documentation under the terms of the CERN OHL v.1.1. (http://ohwr.org/CERNOHL). This documentation is distributed WITHOUT ANY EXPRESS OR IMPLIED WARRANTY, INCLUDING OF MERCHANTABILITY, SATISFACTORY QUALITY AND FITNESS FOR A PARTICULAR PURPOSE. Please see the CERN OHL v.1.1 for applicable conditions.
- Contact
- File
- Last Mod.
- Print Date
- Sheet
- Size
- A3
- of
- Rev
- (in symbol PCBM_WIZNET_WIZ550WEB) J1; RJ45; J2; CCD HVPS Controller; PCB Module

### Library data of the parts
PCBM2 = PCBM_WIZNET_WIZ550WEB: Embedded Web Server Module base on W5500 TCP/IP Chip; Manufacturer: WIZNET; PressFit: No; Bonding: No; Part Number: PCBM_WIZNET_WIZ550WEB; Component Kind: Standard; Component Type: Standard; Device: WIZ550WEB; PackageDescription: Embedded Web Server Module base on W5500 TCP/IP Chip; Part Description: Embedded Web Server Module base on W5500 TCP/IP Chip; Manufacturer Part Number: WIZ550WEB; Pin Count: 37; Mounted: Yes; Socket: No; SMD: No; Sense: No; ComponentHeight: 24.5mm; Author: CERN DEM MR; HelpURL: \\cern.ch\dfs\Applications\Altium\Datasheets\PCBM_WIZNET_WIZ550WEB.pdf; CreateDate: 20/07/2016; LatestRevisionDate: 20/07/2016

## Sheet Beaglebone_black.SchDoc: Humpback
size 420 x 297 mm; Author: G.Kasprowicz; CompanyName: WUT ISE; DrawnBy: G.Kasprowicz; Organization: WUT ISE; Address1: PW ISE; Address2: Nowowiejska 15/19 00-665 Warsaw; Address3: gkasprow@gmail.com; DocumentNumber: 8; Revision: 1.0; SheetNumber: 8; SheetTotal: 11; ModifiedBy: -; CheckedDate: -; Title2: Beaglebone black v1.0; DivGrp: WUT ISE; Designer: G.Kasprowicz; ModifiedDate: -; ProjectName: Sensor Box
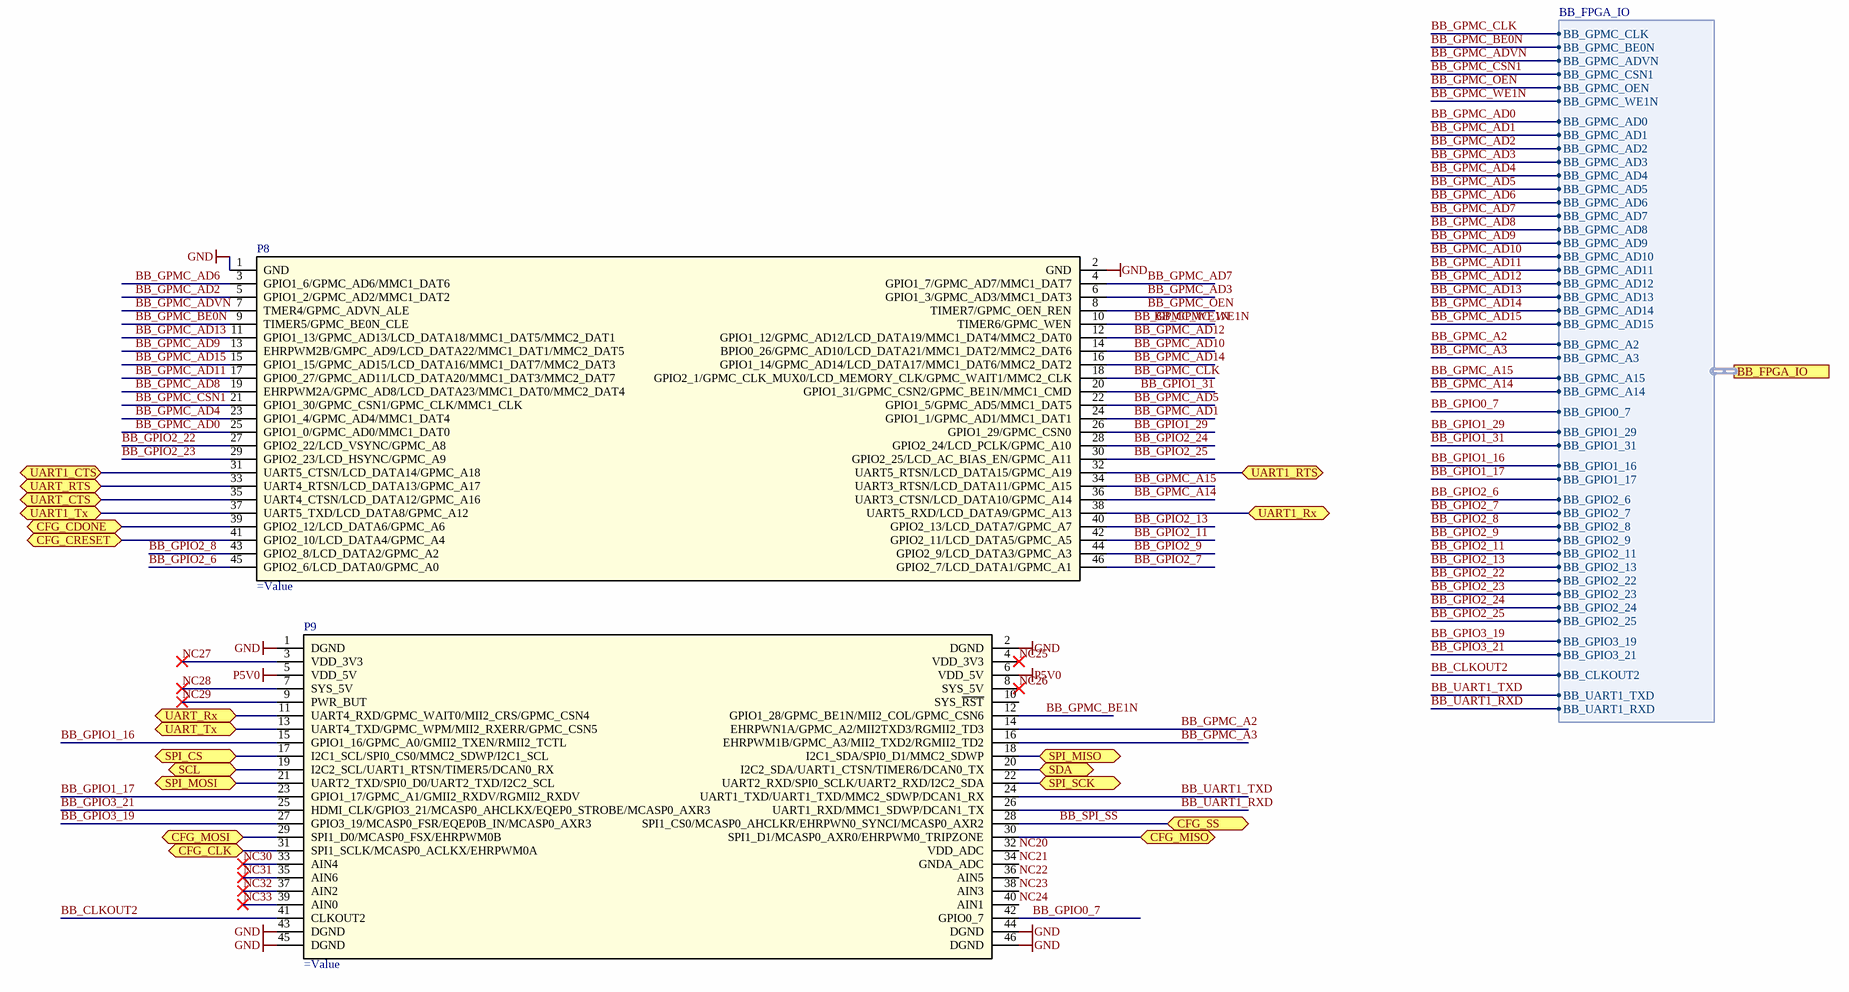
[diagram p10: Beaglebone_black.SchDoc]

### Parts
P8  (no value)  [MOD_BEAGLEBONE_P8]
P9  (no value)  [MOD_BEAGLEBONE_P9]

### Ports
BB_FPGA_IO (harness BB_FPGA_IO), CFG_CDONE (bidir), CFG_CLK (bidir), CFG_CRESET (bidir), CFG_MISO (bidir), CFG_MOSI (bidir), CFG_SS (bidir), SCL (bidir), SDA (bidir), SPI_CS (bidir), SPI_MISO (bidir), SPI_MOSI (bidir), SPI_SCK (bidir), UART1_CTS (bidir), UART1_RTS (bidir), UART1_Rx (bidir), UART1_Tx (bidir), UART_CTS (bidir), UART_RTS (bidir), UART_Rx (bidir), UART_Tx (bidir)

### Harnesses
BB_FPGA_IO: BB_GPMC_CLK, BB_GPMC_BE0N, BB_GPMC_CSN1, BB_GPMC_OEN, BB_GPMC_AD0, BB_GPMC_AD1, BB_GPMC_AD2, BB_GPMC_AD3, BB_GPMC_AD4, BB_GPMC_AD5, BB_GPMC_AD6, BB_GPMC_AD7, BB_GPMC_AD8, BB_GPMC_AD9, BB_GPMC_AD10, BB_GPMC_AD11, BB_GPMC_AD12, BB_GPMC_AD13, BB_GPMC_AD14, BB_GPMC_AD15, BB_GPMC_A2, BB_GPMC_A3, BB_GPMC_A15, BB_GPMC_A14, BB_GPIO0_7, BB_GPIO1_29, BB_GPIO1_31, BB_GPIO1_16, BB_GPIO1_17, BB_GPIO2_6, BB_GPIO2_7, BB_GPIO2_8, BB_GPIO2_9, BB_GPIO2_11, BB_GPIO2_13, BB_GPIO2_22, BB_GPIO2_23, BB_GPIO2_24, BB_GPIO2_25, BB_GPIO3_19, BB_GPIO3_21, BB_CLKOUT2, BB_UART1_TXD, BB_UART1_RXD, BB_GPMC_ADVN, BB_GPMC_WE1N

### Nets
GND: P8.1(GND) P8.2(GND) P9.1(DGND) P9.2(DGND) P9.43(DGND) P9.44(DGND) P9.45(DGND) P9.46(DGND)
P5V0: P9.5(VDD_5V) P9.6(VDD_5V)
BB_CLKOUT2: P9.41(CLKOUT2) ; port BB_FPGA_IO.BB_CLKOUT2
BB_GPIO0_7: P9.42(GPIO0_7) ; port BB_FPGA_IO.BB_GPIO0_7
BB_GPIO1_16: P9.15(GPIO1_16/GPMC_A0/GMII2_TXEN/RMII2_TCTL) ; port BB_FPGA_IO.BB_GPIO1_16
BB_GPIO1_17: P9.23(GPIO1_17/GPMC_A1/GMII2_RXDV/RGMII2_RXDV) ; port BB_FPGA_IO.BB_GPIO1_17
BB_GPIO1_29: P8.26(GPIO1_29/GPMC_CSN0) ; port BB_FPGA_IO.BB_GPIO1_29
BB_GPIO1_31: P8.20(GPIO1_31/GPMC_CSN2/GPMC_BE1N/MMC1_CMD) ; port BB_FPGA_IO.BB_GPIO1_31
BB_GPIO2_6: P8.45(GPIO2_6/LCD_DATA0/GPMC_A0) ; port BB_FPGA_IO.BB_GPIO2_6
BB_GPIO2_7: P8.46(GPIO2_7/LCD_DATA1/GPMC_A1) ; port BB_FPGA_IO.BB_GPIO2_7
BB_GPIO2_8: P8.43(GPIO2_8/LCD_DATA2/GPMC_A2) ; port BB_FPGA_IO.BB_GPIO2_8
BB_GPIO2_9: P8.44(GPIO2_9/LCD_DATA3/GPMC_A3) ; port BB_FPGA_IO.BB_GPIO2_9
BB_GPIO2_11: P8.42(GPIO2_11/LCD_DATA5/GPMC_A5) ; port BB_FPGA_IO.BB_GPIO2_11
BB_GPIO2_13: P8.40(GPIO2_13/LCD_DATA7/GPMC_A7) ; port BB_FPGA_IO.BB_GPIO2_13
BB_GPIO2_22: P8.27(GPIO2_22/LCD_VSYNC/GPMC_A8) ; port BB_FPGA_IO.BB_GPIO2_22
BB_GPIO2_23: P8.29(GPIO2_23/LCD_HSYNC/GPMC_A9) ; port BB_FPGA_IO.BB_GPIO2_23
BB_GPIO2_24: P8.28(GPIO2_24/LCD_PCLK/GPMC_A10) ; port BB_FPGA_IO.BB_GPIO2_24
BB_GPIO2_25: P8.30(GPIO2_25/LCD_AC_BIAS_EN/GPMC_A11) ; port BB_FPGA_IO.BB_GPIO2_25
BB_GPIO3_19: P9.27(GPIO3_19/MCASP0_FSR/EQEP0B_IN/MCASP0_AXR3) ; port BB_FPGA_IO.BB_GPIO3_19
BB_GPIO3_21: P9.25(HDMI_CLK/GPIO3_21/MCASP0_AHCLKX/EQEP0_STROBE/MCASP0_AXR3) ; port BB_FPGA_IO.BB_GPIO3_21
BB_GPMC_A2: P9.14(EHRPWN1A/GPMC_A2/MII2TXD3/RGMII2_TD3) ; port BB_FPGA_IO.BB_GPMC_A2
BB_GPMC_A3: P9.16(EHRPWM1B/GPMC_A3/MII2_TXD2/RGMII2_TD2) ; port BB_FPGA_IO.BB_GPMC_A3
BB_GPMC_A14: P8.36(UART3_CTSN/LCD_DATA10/GPMC_A14) ; port BB_FPGA_IO.BB_GPMC_A14
BB_GPMC_A15: P8.34(UART3_RTSN/LCD_DATA11/GPMC_A15) ; port BB_FPGA_IO.BB_GPMC_A15
BB_GPMC_AD0: P8.25(GPIO1_0/GPMC_AD0/MMC1_DAT0) ; port BB_FPGA_IO.BB_GPMC_AD0
BB_GPMC_AD1: P8.24(GPIO1_1/GPMC_AD1/MMC1_DAT1) ; port BB_FPGA_IO.BB_GPMC_AD1
BB_GPMC_AD2: P8.5(GPIO1_2/GPMC_AD2/MMC1_DAT2) ; port BB_FPGA_IO.BB_GPMC_AD2
BB_GPMC_AD3: P8.6(GPIO1_3/GPMC_AD3/MMC1_DAT3) ; port BB_FPGA_IO.BB_GPMC_AD3
BB_GPMC_AD4: P8.23(GPIO1_4/GPMC_AD4/MMC1_DAT4) ; port BB_FPGA_IO.BB_GPMC_AD4
BB_GPMC_AD5: P8.22(GPIO1_5/GPMC_AD5/MMC1_DAT5) ; port BB_FPGA_IO.BB_GPMC_AD5
BB_GPMC_AD6: P8.3(GPIO1_6/GPMC_AD6/MMC1_DAT6) ; port BB_FPGA_IO.BB_GPMC_AD6
BB_GPMC_AD7: P8.4(GPIO1_7/GPMC_AD7/MMC1_DAT7) ; port BB_FPGA_IO.BB_GPMC_AD7
BB_GPMC_AD8: P8.19(EHRPWM2A/GPMC_AD8/LCD_DATA23/MMC1_DAT0/MMC2_DAT4) ; port BB_FPGA_IO.BB_GPMC_AD8
BB_GPMC_AD9: P8.13(EHRPWM2B/GMPC_AD9/LCD_DATA22/MMC1_DAT1/MMC2_DAT5) ; port BB_FPGA_IO.BB_GPMC_AD9
BB_GPMC_AD10: P8.14(BPIO0_26/GPMC_AD10/LCD_DATA21/MMC1_DAT2/MMC2_DAT6) ; port BB_FPGA_IO.BB_GPMC_AD10
BB_GPMC_AD11: P8.17(GPIO0_27/GPMC_AD11/LCD_DATA20/MMC1_DAT3/MMC2_DAT7) ; port BB_FPGA_IO.BB_GPMC_AD11
BB_GPMC_AD12: P8.12(GPIO1_12/GPMC_AD12/LCD_DATA19/MMC1_DAT4/MMC2_DAT0) ; port BB_FPGA_IO.BB_GPMC_AD12
BB_GPMC_AD13: P8.11(GPIO1_13/GPMC_AD13/LCD_DATA18/MMC1_DAT5/MMC2_DAT1) ; port BB_FPGA_IO.BB_GPMC_AD13
BB_GPMC_AD14: P8.16(GPIO1_14/GPMC_AD14/LCD_DATA17/MMC1_DAT6/MMC2_DAT2) ; port BB_FPGA_IO.BB_GPMC_AD14
BB_GPMC_AD15: P8.15(GPIO1_15/GPMC_AD15/LCD_DATA16/MMC1_DAT7/MMC2_DAT3) ; port BB_FPGA_IO.BB_GPMC_AD15
BB_GPMC_ADVN: P8.7(TMER4/GPMC_ADVN_ALE) ; port BB_FPGA_IO.BB_GPMC_ADVN
BB_GPMC_BE0N: P8.9(TIMER5/GPMC_BE0N_CLE) ; port BB_FPGA_IO.BB_GPMC_BE0N
BB_GPMC_BE1N: P9.12(GPIO1_28/GPMC_BE1N/MII2_COL/GPMC_CSN6)
BB_GPMC_CLK: P8.18(GPIO2_1/GPMC_CLK_MUX0/LCD_MEMORY_CLK/GPMC_WAIT1/MMC2_CLK) ; port BB_FPGA_IO.BB_GPMC_CLK
BB_GPMC_CSN1: P8.21(GPIO1_30/GPMC_CSN1/GPMC_CLK/MMC1_CLK) ; port BB_FPGA_IO.BB_GPMC_CSN1
BB_GPMC_OEN: P8.8(TIMER7/GPMC_OEN_REN) ; port BB_FPGA_IO.BB_GPMC_OEN
BB_GPMC_WE1N: P8.10(TIMER6/GPMC_WEN) ; port BB_FPGA_IO.BB_GPMC_WE1N
BB_SPI_SS: P9.28(SPI1_CS0/MCASP0_AHCLKR/EHRPWN0_SYNCI/MCASP0_AXR2) ; port CFG_SS  [project net CFG_SS]
BB_UART1_RXD: P9.26(UART1_RXD/MMC1_SDWP/DCAN1_TX) ; port BB_FPGA_IO.BB_UART1_RXD
BB_UART1_TXD: P9.24(UART1_TXD/UART1_TXD/MMC2_SDWP/DCAN1_RX) ; port BB_FPGA_IO.BB_UART1_TXD
CFG_CDONE: P8.39(GPIO2_12/LCD_DATA6/GPMC_A6) ; port CFG_CDONE
CFG_CLK: P9.31(SPI1_SCLK/MCASP0_ACLKX/EHRPWM0A) ; port CFG_CLK
CFG_CRESET: P8.41(GPIO2_10/LCD_DATA4/GPMC_A4) ; port CFG_CRESET
CFG_MISO: P9.30(SPI1_D1/MCASP0_AXR0/EHRPWM0_TRIPZONE) ; port CFG_MISO
CFG_MOSI: P9.29(SPI1_D0/MCASP0_FSX/EHRPWM0B) ; port CFG_MOSI
NC20: P9.32(VDD_ADC)
NC21: P9.34(GNDA_ADC)
NC22: P9.36(AIN5)
NC23: P9.38(AIN3)
NC24: P9.40(AIN1)
NC25: P9.4(VDD_3V3)
NC26: P9.8(SYS_5V)
NC27: P9.3(VDD_3V3)
NC28: P9.7(SYS_5V)
NC29: P9.9(PWR_BUT)
NC30: P9.33(AIN4)
NC31: P9.35(AIN6)
NC32: P9.37(AIN2)
NC33: P9.39(AIN0)
SCL: P9.19(I2C2_SCL/UART1_RTSN/TIMER5/DCAN0_RX) ; port SCL
SDA: P9.20(I2C2_SDA/UART1_CTSN/TIMER6/DCAN0_TX) ; port SDA
SPI_CS: P9.17(I2C1_SCL/SPI0_CS0/MMC2_SDWP/I2C1_SCL) ; port SPI_CS
SPI_MISO: P9.18(I2C1_SDA/SPI0_D1/MMC2_SDWP) ; port SPI_MISO
SPI_MOSI: P9.21(UART2_TXD/SPI0_D0/UART2_TXD/I2C2_SCL) ; port SPI_MOSI
SPI_SCK: P9.22(UART2_RXD/SPI0_SCLK/UART2_RXD/I2C2_SDA) ; port SPI_SCK
UART1_CTS: P8.31(UART5_CTSN/LCD_DATA14/GPMC_A18) ; port UART1_CTS
UART1_RTS: P8.32(UART5_RTSN/LCD_DATA15/GPMC_A19) ; port UART1_RTS
UART1_Rx: P8.38(UART5_RXD/LCD_DATA9/GPMC_A13) ; port UART1_Rx
UART1_Tx: P8.37(UART5_TXD/LCD_DATA8/GPMC_A12) ; port UART1_Tx
UART_CTS: P8.35(UART4_CTSN/LCD_DATA12/GPMC_A16) ; port UART_CTS
UART_RTS: P8.33(UART4_RTSN/LCD_DATA13/GPMC_A17) ; port UART_RTS
UART_Rx: P9.11(UART4_RXD/GPMC_WAIT0/MII2_CRS/GPMC_CSN4) ; port UART_Rx
UART_Tx: P9.13(UART4_TXD/GPMC_WPM/MII2_RXERR/GPMC_CSN5) ; port UART_Tx

Not connected (* = marked no-connect by the designer): P9 10(SYS_~{RST})

### Notes on the sheet
- Project/Equipment
- Document
- Designer
- Drawn by
- Check.by
- Copyright WUT ISE 2018.
  This documentation describes Open Hardware and is licensed under the CERN OHL v.1.1. You may redistribute and modify this documentation under the terms of the CERN OHL v.1.1. (http://ohwr.org/CERNOHL). This documentation is distributed WITHOUT ANY EXPRESS OR IMPLIED WARRANTY, INCLUDING OF MERCHANTABILITY, SATISFACTORY QUALITY AND FITNESS FOR A PARTICULAR PURPOSE. Please see the CERN OHL v.1.1 for applicable conditions.
- Contact
- File
- Last Mod.
- Print Date
- Sheet
- Size
- A3
- of
- Rev

### Library data of the parts
P8 = MOD_Beagle_Bone_Black_P8-SSQ: Beagle_Bone_Black_P8; Manufacturer: Samtec Inc; Connector Type: Receptacle; Number of Positions: 46; Number of Positions Loaded: All; Pitch: 0.100" (2.54mm); Supplier 1: Digi-Key; RoHS: RoHS Compliant; Category: Connectors, Interconnects; Stock 1: 0; Pricing 1: 1=0 (USD); Packaging: Bulk; Contact Type: Male header; Number of Rows: 2; Row Spacing: 0.100" (2.54mm); Termination: Solder; Fastening Type: -; Features: -; Contact Finish: Gold; Contact Finish Thickness: 20µin (0.51µm); Color: Black; ComponentLink1URL: http://www.samtec.com/documents/webfiles/cpdf/SSQ-1XX-XX-XXX-X-XX-XXX-XX-X-MKT.pdf; ComponentLink1Description: http://www.samtec.com/documents/webfiles/cpdf/SSQ-1XX-XX-XXX-X-XX-XXX-XX-X-MKT.pdf
P9 = MOD_Beagle_Bone_Black_P9-SSQ: Beagle_Bone_Black_P9; Manufacturer: Samtec Inc; Connector Type: Receptacle; Number of Positions: 46; Number of Positions Loaded: All; Pitch: 0.100" (2.54mm); Supplier 1: Digi-Key; RoHS: RoHS Compliant; Category: Connectors, Interconnects; Stock 1: 0; Pricing 1: 1=0 (USD); Packaging: Bulk; Contact Type: Male header; Number of Rows: 2; Row Spacing: 0.100" (2.54mm); Termination: Solder; Fastening Type: -; Features: -; Contact Finish: Gold; Contact Finish Thickness: 20µin (0.51µm); Color: Black; ComponentLink1URL: http://www.samtec.com/documents/webfiles/cpdf/SSQ-1XX-XX-XXX-X-XX-XXX-XX-X-MKT.pdf; ComponentLink1Description: http://www.samtec.com/documents/webfiles/cpdf/SSQ-1XX-XX-XXX-X-XX-XXX-XX-X-MKT.pdf; Supplier Part Number 1: SAM1197-23-ND